# EAGLE design PCBPayloadV7 (EAGLE 9.5.2)
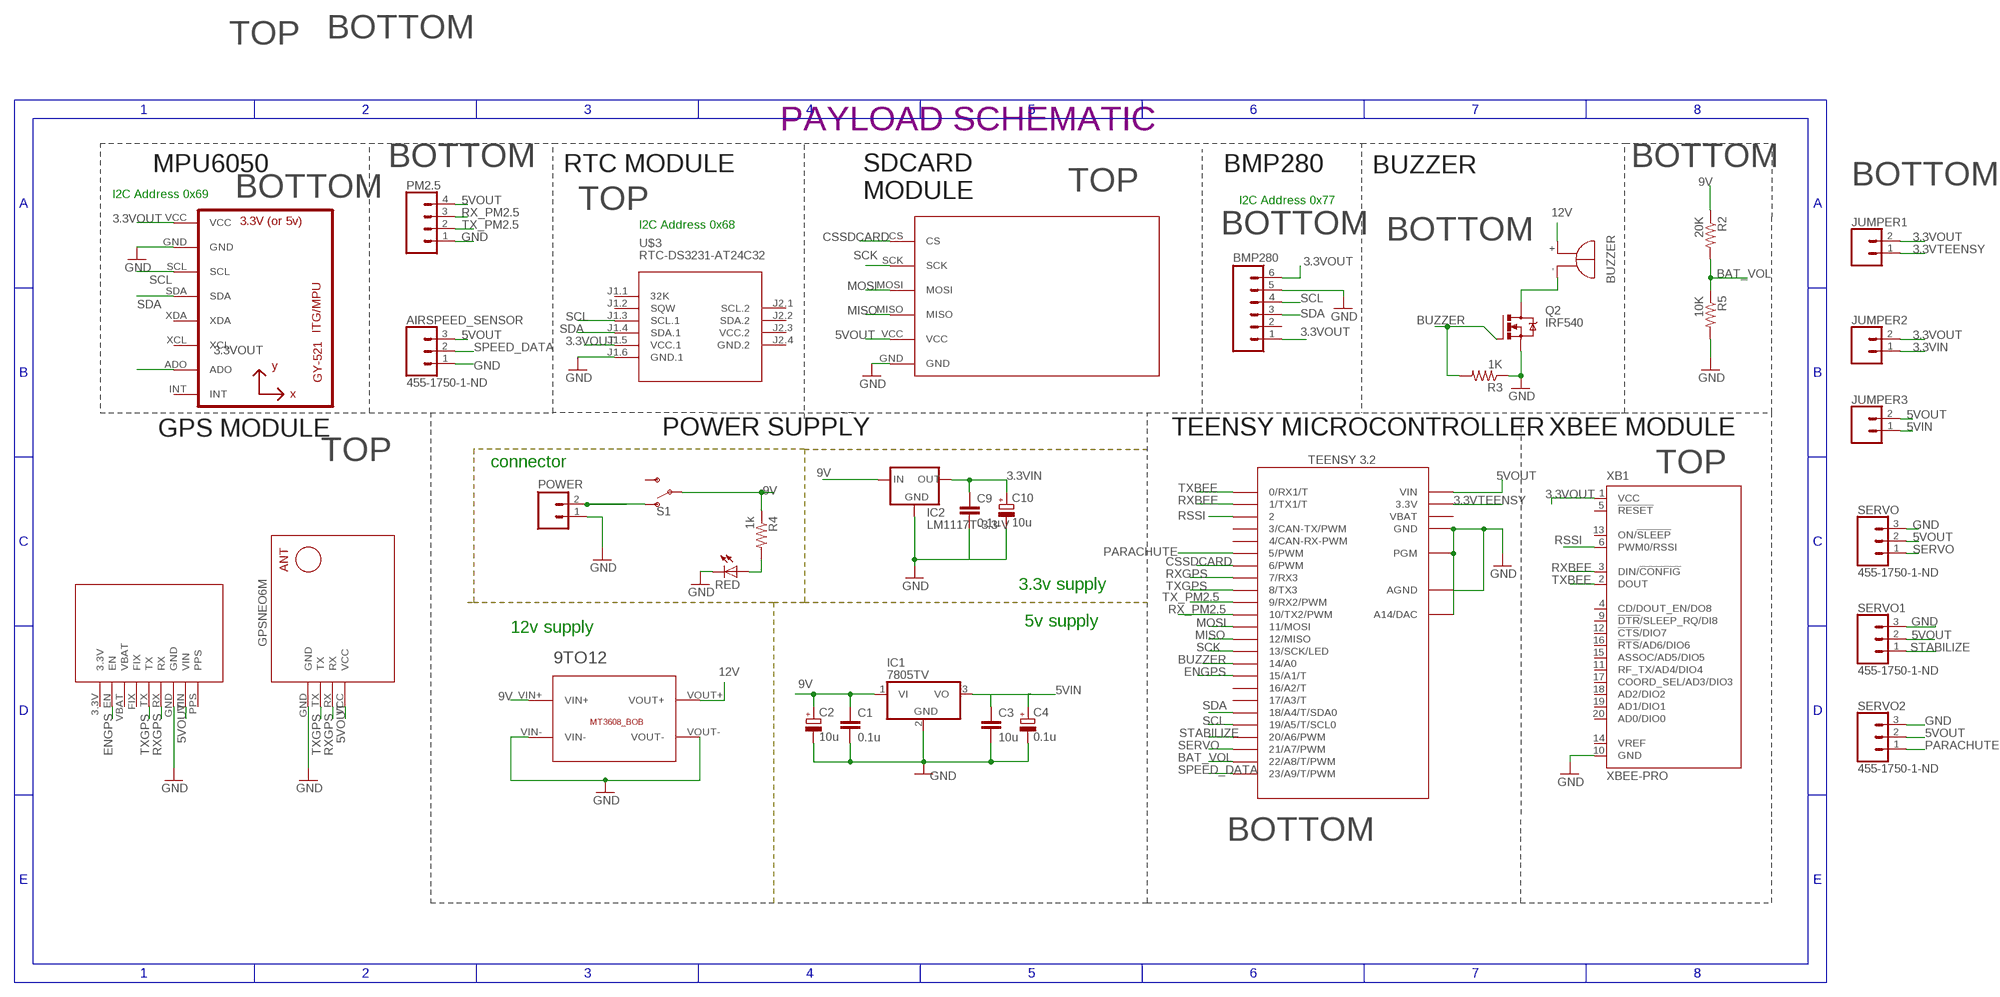
[diagram p0: schematic, sheet 1]

## Parts
9TO12  BREAKOUTS_MT3608_BOB  [BREAKOUTS_MT3608_BOB]
AIRSPEED_SENSOR  455-1750-1-ND  CONN_03  [1X03]
BMP280  M06  [06P]
C1  0.1u  C-EU025-025X050  [C025-025X050]
C2  10u  CPOL-EUE2.5-6  [E2,5-6]
C3  10u  C-EU025-025X050  [C025-025X050]
C4  0.1u  CPOL-EUE2.5-6  [E2,5-6]
C9  0.1u  C-EU025-025X050  [C025-025X050]
C10  10u  CPOL-EUE2.5-6  [E2,5-6]
IC1  7805TV  [TO220V]
IC2  LM1117T-3.3-V  [TO220V]
JUMPER1  CONN_02  [1X02]
JUMPER2  CONN_02  [1X02]
JUMPER3  CONN_02  [1X02]
PM2.5  CONN_04  [1X04]
POWER  CEDT_JANUARY_2015_V5_M02  [CEDT_JANUARY_2015_V5_02P]
Q2  IRF540  [TO220BV]
R2  20K  R-US_0204/7  [0204/7]
R3  1K  R-US_0204/7  [0204/7]
R4  1k  R-US_0204/7  [0204/7]
R5  10K  R-US_0204/7  [0204/7]
RED  red  LED3MM  [LED3MM]
S1  SWITCH-SPDT-PTH-11.6X4.0MM  [SWITCH_SPDT_PTH_11.6X4.0MM]
SERVO  455-1750-1-ND  CONN_03  [1X03]
SERVO1  455-1750-1-ND  CONN_03  [1X03]
SERVO2  455-1750-1-ND  CONN_03  [1X03]
SG1  BUZZER_EB2209A  [BUZZER_EB2209A]
U1  GY-521MPU6050  [GY-521]
U$1  GPS-RECEIVER-NEO6M  [GPS-RECEIVER-NEO6M]
U$2  TEENSY_3.1-3.2_OUTER_ROW  [TEENSY_3.0-3.2&LC_OUTER_ROW]
U$3  RTC-DS3231-AT24C32  [RTC-DS3231-AT24C32]
U$4  ADAFRUIT_GPS  [ADAFRUIT_GPS]
U$5  SDCARD  [M0SDCARDMODULE]
XB1  XBEE-PRO  [XBEE-PRO]

## Nets
3.3VIN: C9.1 C10.+ IC2.2(OUT) JUMPER2.1
3.3VOUT: BMP280.1 BMP280.6 JUMPER1.2 JUMPER2.2 U1.ADO U1.VCC U$3.J1.5(VCC.1) XB1.1(VCC)
3.3VTEENSY: JUMPER1.1 U$2.3.3V U$2.3.3V1(3.3V)
5VIN [power]: C3.1 C4.+ IC1.3(VO) JUMPER3.1
5VOUT: AIRSPEED_SENSOR.3 JUMPER3.2 PM2.5.4 SERVO1.2 SERVO2.2 SERVO.2 U$1.VCC U$2.VIN U$4.VIN U$5.VCC
9V [power]: 9TO12.VIN+ C1.1 C2.+ IC1.1(VI) IC2.3(IN) R2.1 R4.1 S1.2(P)
12V [power]: 9TO12.VOUT+ SG1.+
BAT_VOL: R2.2 R5.1 U$2.22/A8(22/A8/T/PWM)
BUZZER: Q2.G R3.2 U$2.14/A0
CSSDCARD: U$2.6(6/PWM) U$5.CS
ENGPS: U$2.15/A1(15/A1/T) U$4.EN
GND [power]: 9TO12.VIN- 9TO12.VOUT- AIRSPEED_SENSOR.1 BMP280.5 C1.2 C2.- C3.2 C4.- C9.2 C10.- IC1.2(GND) IC2.1(GND) PM2.5.1 POWER.1 Q2.S R3.1 R5.2 RED.K(C) SERVO1.3 SERVO2.3 SERVO.3 U1.GND U$1.GND U$2.AGND U$2.GND U$2.GND1(GND) U$2.PGM U$2.RESET/DAC(A14/DAC) U$3.J1.6(GND.1) U$4.GND U$5.GND XB1.10(GND)
MISO: U$2.12(12/MISO) U$5.MISO
MOSI: U$2.11(11/MOSI) U$5.MOSI
N$1 [power]: POWER.2 S1.1(O)
N$2: R4.2 RED.A
N$3 [power]: Q2.D SG1.-
PARACHUTE: SERVO2.1 U$2.5(5/PWM)
RSSI: U$2.2 XB1.6(PWM0/RSSI)
RX_PM2.5: PM2.5.3 U$2.10(10/TX2/PWM)
RXBEE: U$2.1(1/TX1/T) XB1.3(DIN/!CONFIG)
RXGPS: U$1.RX U$2.7(7/RX3) U$4.RX
SCK: U$2.13(13/SCK/LED) U$5.SCK
SCL: BMP280.4 U1.SCL U$2.19/A5(19/A5/T/SCL0) U$3.J1.3(SCL.1)
SDA: BMP280.3 U1.SDA U$2.18/A4(18/A4/T/SDA0) U$3.J1.4(SDA.1)
SERVO: SERVO.1 U$2.21/A7(21/A7/PWM)
SPEED_DATA: AIRSPEED_SENSOR.2 U$2.23/A9(23/A9/T/PWM)
STABILIZE: SERVO1.1 U$2.20/A6(20/A6/PWM)
TX_PM2.5: PM2.5.2 U$2.9(9/RX2/PWM)
TXBEE: U$2.0(0/RX1/T) XB1.2(DOUT)
TXGPS: U$1.TX U$2.8(8/TX3) U$4.TX
Unconnected: BMP280.2 S1.3(S) U1.INT U1.XCL U1.XDA U$2.3(3/CAN-TX/PWM) U$2.4(4/CAN-RX-PWM) U$2.16/A2(16/A2/T) U$2.17/A3(17/A3/T) U$3.J1.1(32K) U$3.J1.2(SQW) U$3.J2.1(SCL.2) U$3.J2.2(SDA.2) U$4.3.3V U$4.FIX U$4.PPS U$4.VBAT XB1.4(CD/DOUT_EN/DO8) XB1.5(!RESET) XB1.9(!DTR!/SLEEP_RQ/DI8) XB1.11(RF_TX/AD4/DIO4) XB1.12(!CTS!/DIO7) XB1.13(ON/!SLEEP) XB1.14(VREF) XB1.15(ASSOC/AD5/DIO5) XB1.16(!RTS!/AD6/DIO6) XB1.17(COORD_SEL/AD3/DIO3) XB1.18(AD2/DIO2) XB1.19(AD1/DIO1) XB1.20(AD0/DIO0)

## Notes on the sheet
- TOP | BOTTOM
- PAYLOAD SCHEMATIC
- MPU6050 | BOTTOM | RTC MODULE | BMP280 | BUZZER | BOTTOM
- TOP | BOTTOM
- I2C Address 0x69 | BOTTOM
- SDCARD
  MODULE
- I2C Address 0x77
- TOP
- I2C Address 0x68
- BOTTOM | BOTTOM
- GPS MODULE | POWER SUPPLY | TEENSY MICROCONTROLLER | XBEE MODULE
- TOP
- connector
- TOP
- 3.3v supply
- 5v supply
- 12v supply
- BOTTOM

## Power pins joined to a net without a drawn wire
GND.2: U$3.J2.4(GND.2)
VBAT: U$2.VBAT
VCC.2: U$3.J2.3(VCC.2)

## Library data of the parts
9TO12 = Cansat2019_3279_Container_v01:BREAKOUTS_MT3608_BOB
AIRSPEED_SENSOR SERVO SERVO1 SERVO2 = SparkFun-Connectors:CONN_03: Multi connection point. Often used as Generic Header-pin footprint for 0.1 inch spaced/style header connections On any of the 0.1 inch spaced packages, you can populate with these: Break Away Headers - Straight <https://www.sparkfun.com/products/116> (PRT-00116) Break Away Male Headers - Right Angle <https://www.sparkfun.com/products/553> (PRT-00553) Female Headers <https://www.sparkfun.com/products/115> (PRT-00115) Break Away Headers - Machine Pin <https://www.sparkfun.com/products/117> (PRT-00117) Break Away Female Headers - Swiss Machine Pin <https://www.sparkfun.com/products/743> (PRT-00743) Stackable Header - 3 Pin (Female, 0.1") <https://www.sparkfun.com/products/13875> (PRT-13875) For SCREWTERMINALS and SPRING TERMINALS visit here: Screw Terimnals on SparkFun.com <https://www.sparkfun.com/search/results?term=Screw+Terminals> (5mm/3.5mm/2.54mm spacing) This device is also useful as a general connection point to wire up your design to another part of your project. Our various solder wires solder well into these plated through hole pads. Hook-Up Wire - Assortment (Stranded, 22 AWG) <https://www.sparkfun.com/products/11375> (PRT-11375) Hook-Up Wire - Assortment (Solid Core, 22 AWG) <https://www.sparkfun.com/products/11367> (PRT-11367) View the entire wire category on our website here <https://www.sparkfun.com/categories/141> Special notes: Molex polarized connector foot print use with SKU : PRT-08232 with associated crimp pins and housings.; PROD_ID: XXX-00000
BMP280 = con-amp-quick:M06: AMP QUICK CONNECTOR; OC_FARNELL: unknown; OC_NEWARK: unknown
C1 C3 C9 = resistor:C-EU: CAPACITOR, European symbol
C2 C4 C10 = rcl:CPOL-EU: POLARIZED CAPACITOR, European symbol; SPICEPREFIX: C
IC1 = linear:78*: Positive VOLTAGE REGULATOR Source: http://cache.national.com/ds/LM/LM78L05.pdf http://www.fairchildsemi.com/ds/LM/LM7805.pdf
IC2 = lm1117:LM1117T-*
JUMPER1-JUMPER3 = SparkFun-Connectors:CONN_02: Multi connection point. Often used as Generic Header-pin footprint for 0.1 inch spaced/style header connections On any of the 0.1 inch spaced packages, you can populate with these: Break Away Headers - Straight <https://www.sparkfun.com/products/116> (PRT-00116) Break Away Male Headers - Right Angle <https://www.sparkfun.com/products/553> (PRT-00553) Female Headers <https://www.sparkfun.com/products/115> (PRT-00115) Break Away Headers - Machine Pin <https://www.sparkfun.com/products/117> (PRT-00117) Break Away Female Headers - Swiss Machine Pin <https://www.sparkfun.com/products/743> (PRT-00743) For SCREWTERMINALS and SPRING TERMINALS visit here: Screw Terimnals on SparkFun.com <https://www.sparkfun.com/search/results?term=Screw+Terminals> (5mm/3.5mm/2.54mm spacing) This device is also useful as a general connection point to wire up your design to another part of your project. Our various solder wires solder well into these plated through hole pads. Hook-Up Wire - Assortment (Stranded, 22 AWG) <https://www.sparkfun.com/products/11375> (PRT-11375) Hook-Up Wire - Assortment (Solid Core, 22 AWG) <https://www.sparkfun.com/products/11367> (PRT-11367) View the entire wire category on our website here <https://www.sparkfun.com/categories/141> Special notes: Molex polarized connector foot print use with: PRT-08233 with associated crimp pins and housings. 2.54_SCREWTERM for use with PRT-10571. 3.5mm Screw Terminal footprints for PRT-08084 5mm Screw Terminal footprints for use with PRT-08432
PM2.5 = SparkFun-Connectors:CONN_04: Multi connection point. Often used as Generic Header-pin footprint for 0.1 inch spaced/style header connections On any of the 0.1 inch spaced packages, you can populate with these: Break Away Headers - Straight <https://www.sparkfun.com/products/116> (PRT-00116) Break Away Male Headers - Right Angle <https://www.sparkfun.com/products/553> (PRT-00553) Female Headers <https://www.sparkfun.com/products/115> (PRT-00115) Break Away Headers - Machine Pin <https://www.sparkfun.com/products/117> (PRT-00117) Break Away Female Headers - Swiss Machine Pin <https://www.sparkfun.com/products/743> (PRT-00743) For SCREWTERMINALS and SPRING TERMINALS visit here: Screw Terimnals on SparkFun.com <https://www.sparkfun.com/search/results?term=Screw+Terminals> (5mm/3.5mm/2.54mm spacing) This device is also useful as a general connection point to wire up your design to another part of your project. Our various solder wires solder well into these plated through hole pads. Hook-Up Wire - Assortment (Stranded, 22 AWG) <https://www.sparkfun.com/products/11375> (PRT-11375) Hook-Up Wire - Assortment (Solid Core, 22 AWG) <https://www.sparkfun.com/products/11367> (PRT-11367) View the entire wire category on our website here <https://www.sparkfun.com/categories/141> Special notes: Molex polarized connector foot print use with SKU : PRT-08231 with associated crimp pins and housings. 1MM SMD Version SKU: PRT-10208; PROD_ID: CONN-09696
POWER = Cansat2019_3279_Container_v01:CEDT_JANUARY_2015_V5_M02: AMP QUICK CONNECTOR
Q2 = transistor-power:IRF540: HEXFET Power MOSFET
R2-R5 = rcl:R-US_: RESISTOR, American symbol; SPICEPREFIX: R
RED = CEDT_JANUARY_2015_v5:LED
S1 = SparkFun-Switches:SWITCH-SPDT: Single Pole, Double Throw (SPDT) Switch Single-pole, double-throw (SPDT) switch. Variant Overview SMD-AYZ0202 Surface Mount DPDT Switch <https://www.sparkfun.com/products/597> (COM-00597) Used on e.g. LilyPad Arduino USB - ATmega32U4 Board <https://www.sparkfun.com/products/12049> PTH-11.6X4.0MM SPDT Mini Power Switch <https://www.sparkfun.com/products/102> (COM-00102) Used on e.g. SparkFun Simon Says - Through-Hole Soldering Kit <https://www.sparkfun.com/products/10547> (KIT-10547) PTH-11.6X4.0MM-KIT KIT version of SPDT Mini Power Switch - Simplifies soldering by removing tStop of switch pins - only one side can be soldered. PTH-11.6X4.0MM-LOCK LOCK version of SPDT Mini Power Switch - Offset pins hold switch in place for easier soldering. SMD-RIGHT-ANGLE Surface Mount Right Angle Switch <https://www.sparkfun.com/products/10860> (COM-10860) Used on e.g. SparkFun ESP8266 Thing <https://www.sparkfun.com/products/13231>; PROD_ID: SWCH-08261; SF_SKU: COM-00102
SG1 = Cansat2019_3279_Container_v01:BUZZER_EB2209A: BUZZER Source: Buerklin; OC_FARNELL: unknown; OC_NEWARK: unknown
U1 = gy-521:GY-521
U$1 = diy-modules:GPS-RECEIVER-NEO6M: GPS Receiver Module based on NEO-6 device Short tutorial how to use NEO-6 module with Arduino: http://www.xarg.org/2016/06/neo6mv2-gps-module-with-arduino/ NEO-6 datasheet is available here: https://www.u-blox.com/sites/default/files/products/documents/NEO-6_DataSheet_%28GPS.G6-HW-09005%29.pdf Click here to find device on ebay.com <http://www.ebay.com/sch/gyneo6mv2>
U$2 = Teensy_3_and_LC_Series_Boards_v1.4:TEENSY_3.1-3.2_OUTER_ROW: Footprint for Teensy 3.1 or 3.2 board using all pin connections on the outer perimeter
U$3 = diy-modules:RTC-DS3231-AT24C32: RTC Module with Battery and EEPROM based on DS3231 and AT24C32 chips Tutorial can be found here: https://edwardmallon.wordpress.com/2014/05/21/using-a-cheap-3-ds3231-rtc-at24c32-eeprom-from-ebay/ Click here to find device on ebay.com <http://www.ebay.com/sch/DS3231+AT24C32+module>
U$4 = myLib_adafruit_gps:ADAFRUIT_GPS
U$5 = mylib:SDCARD
XB1 = maxstream:XBEE: XBee (TM) /XBee-PRO(TM) OEM RF Modules Source: MaxStream, Inc. xbee_productmanual.pdf; MPN: XBP24-AWI-001; OC_FARNELL: 1337916; OC_NEWARK: 42M2667

## Net classes
0 default: width 0.508 mm
1 power: width 0.61 mm

## Board
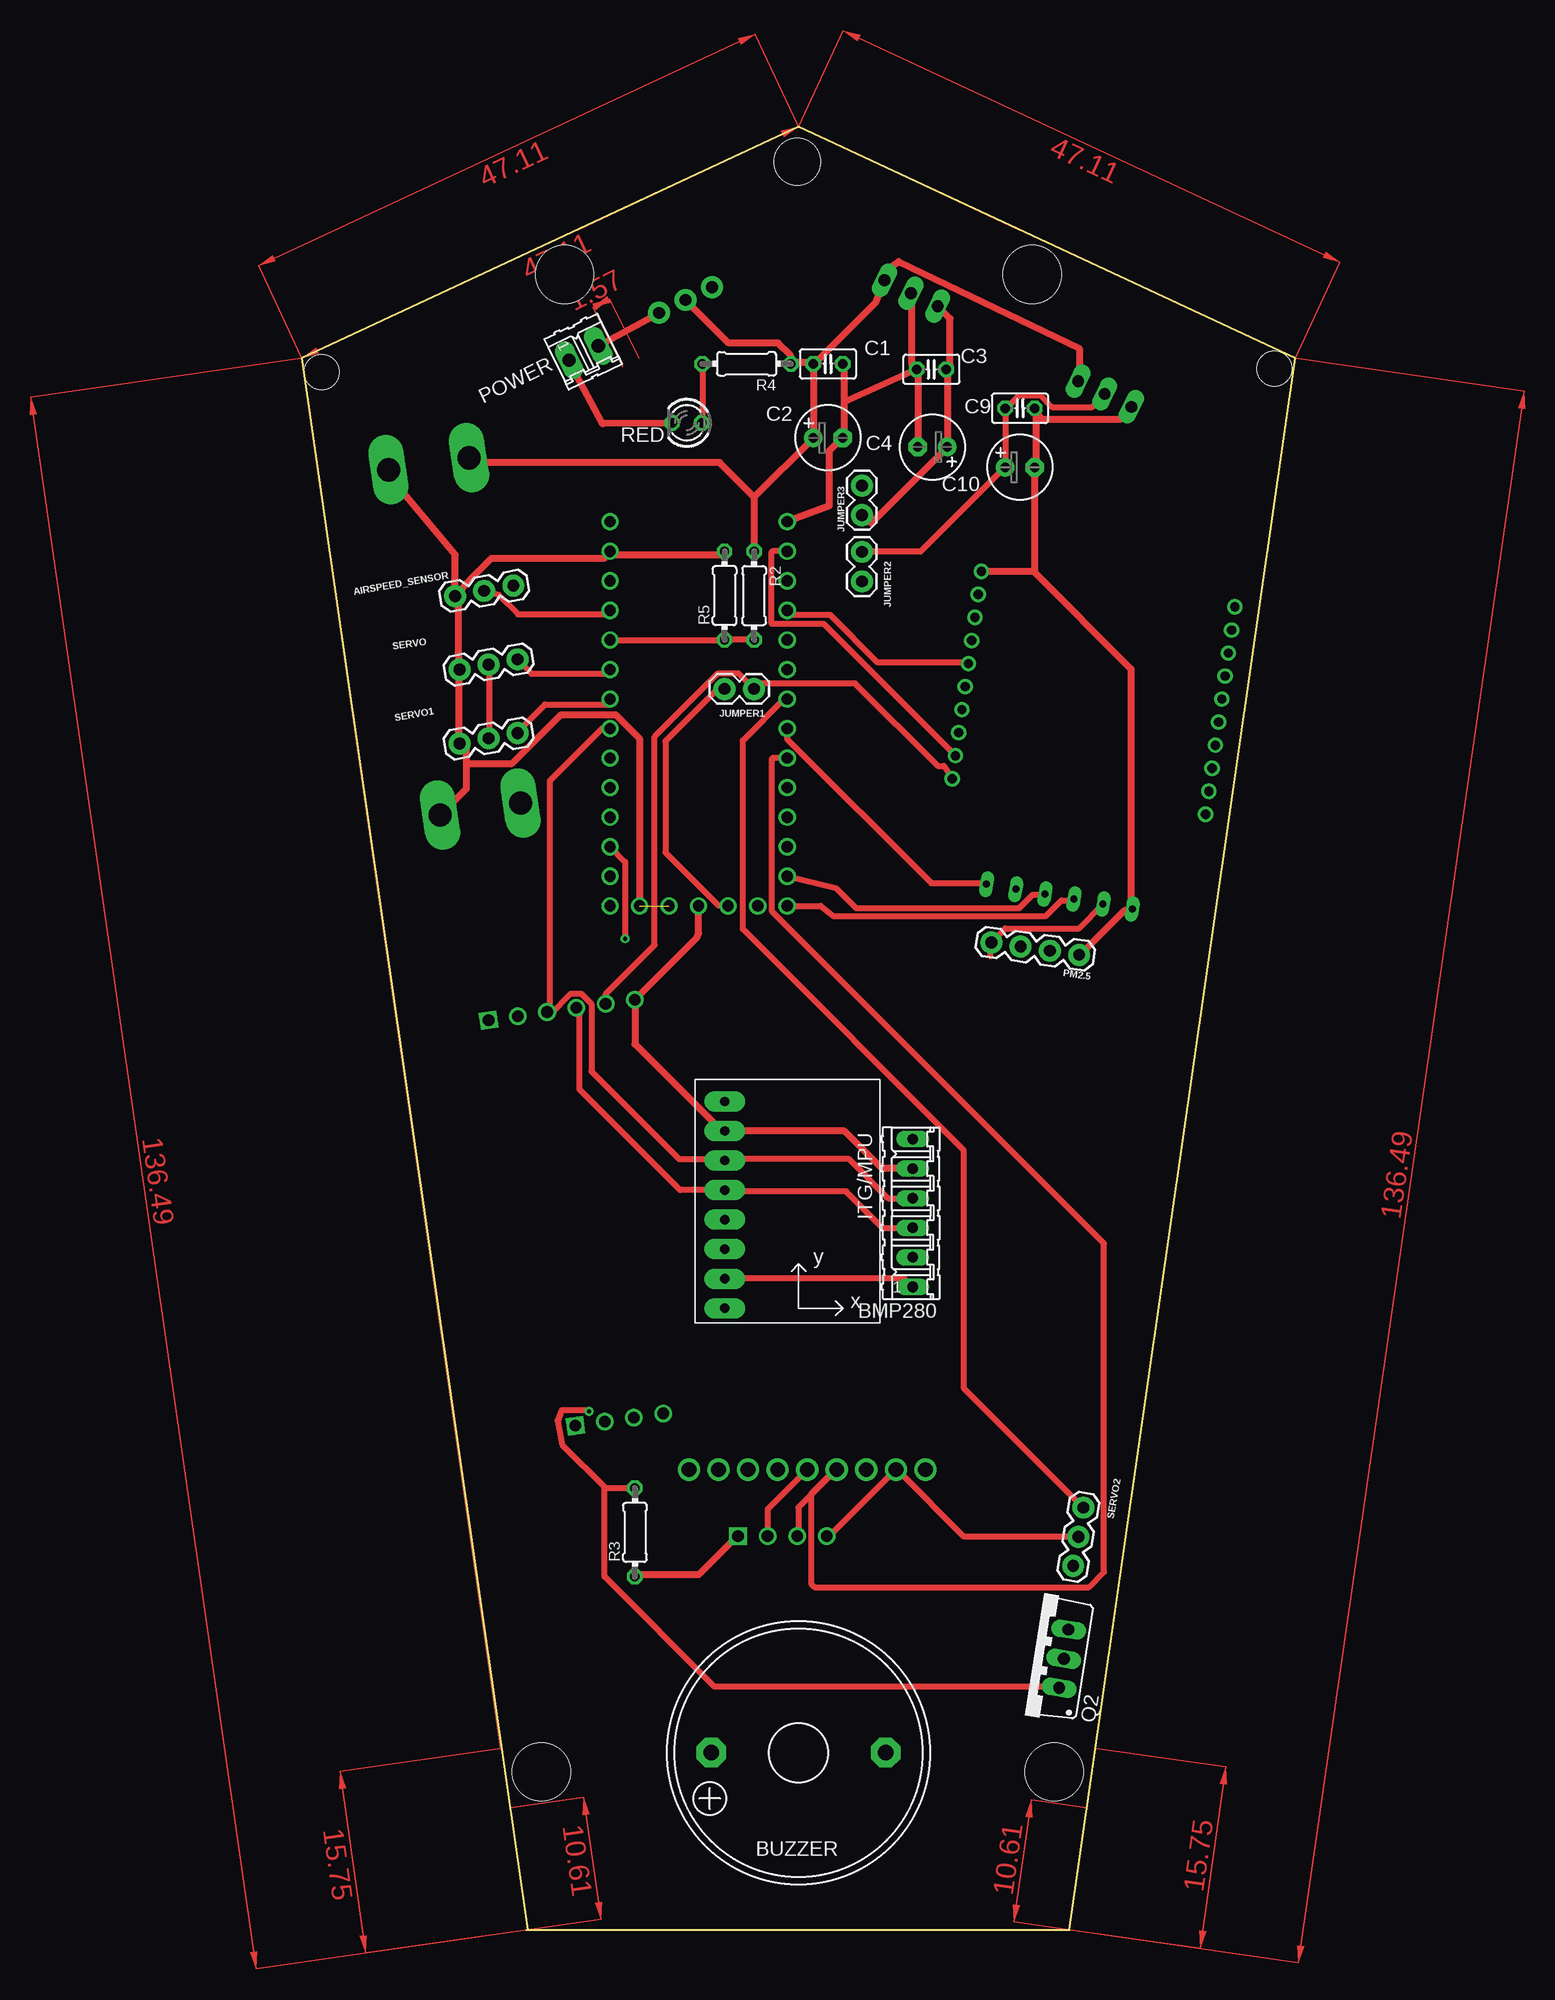
[diagram p1: board, top side]
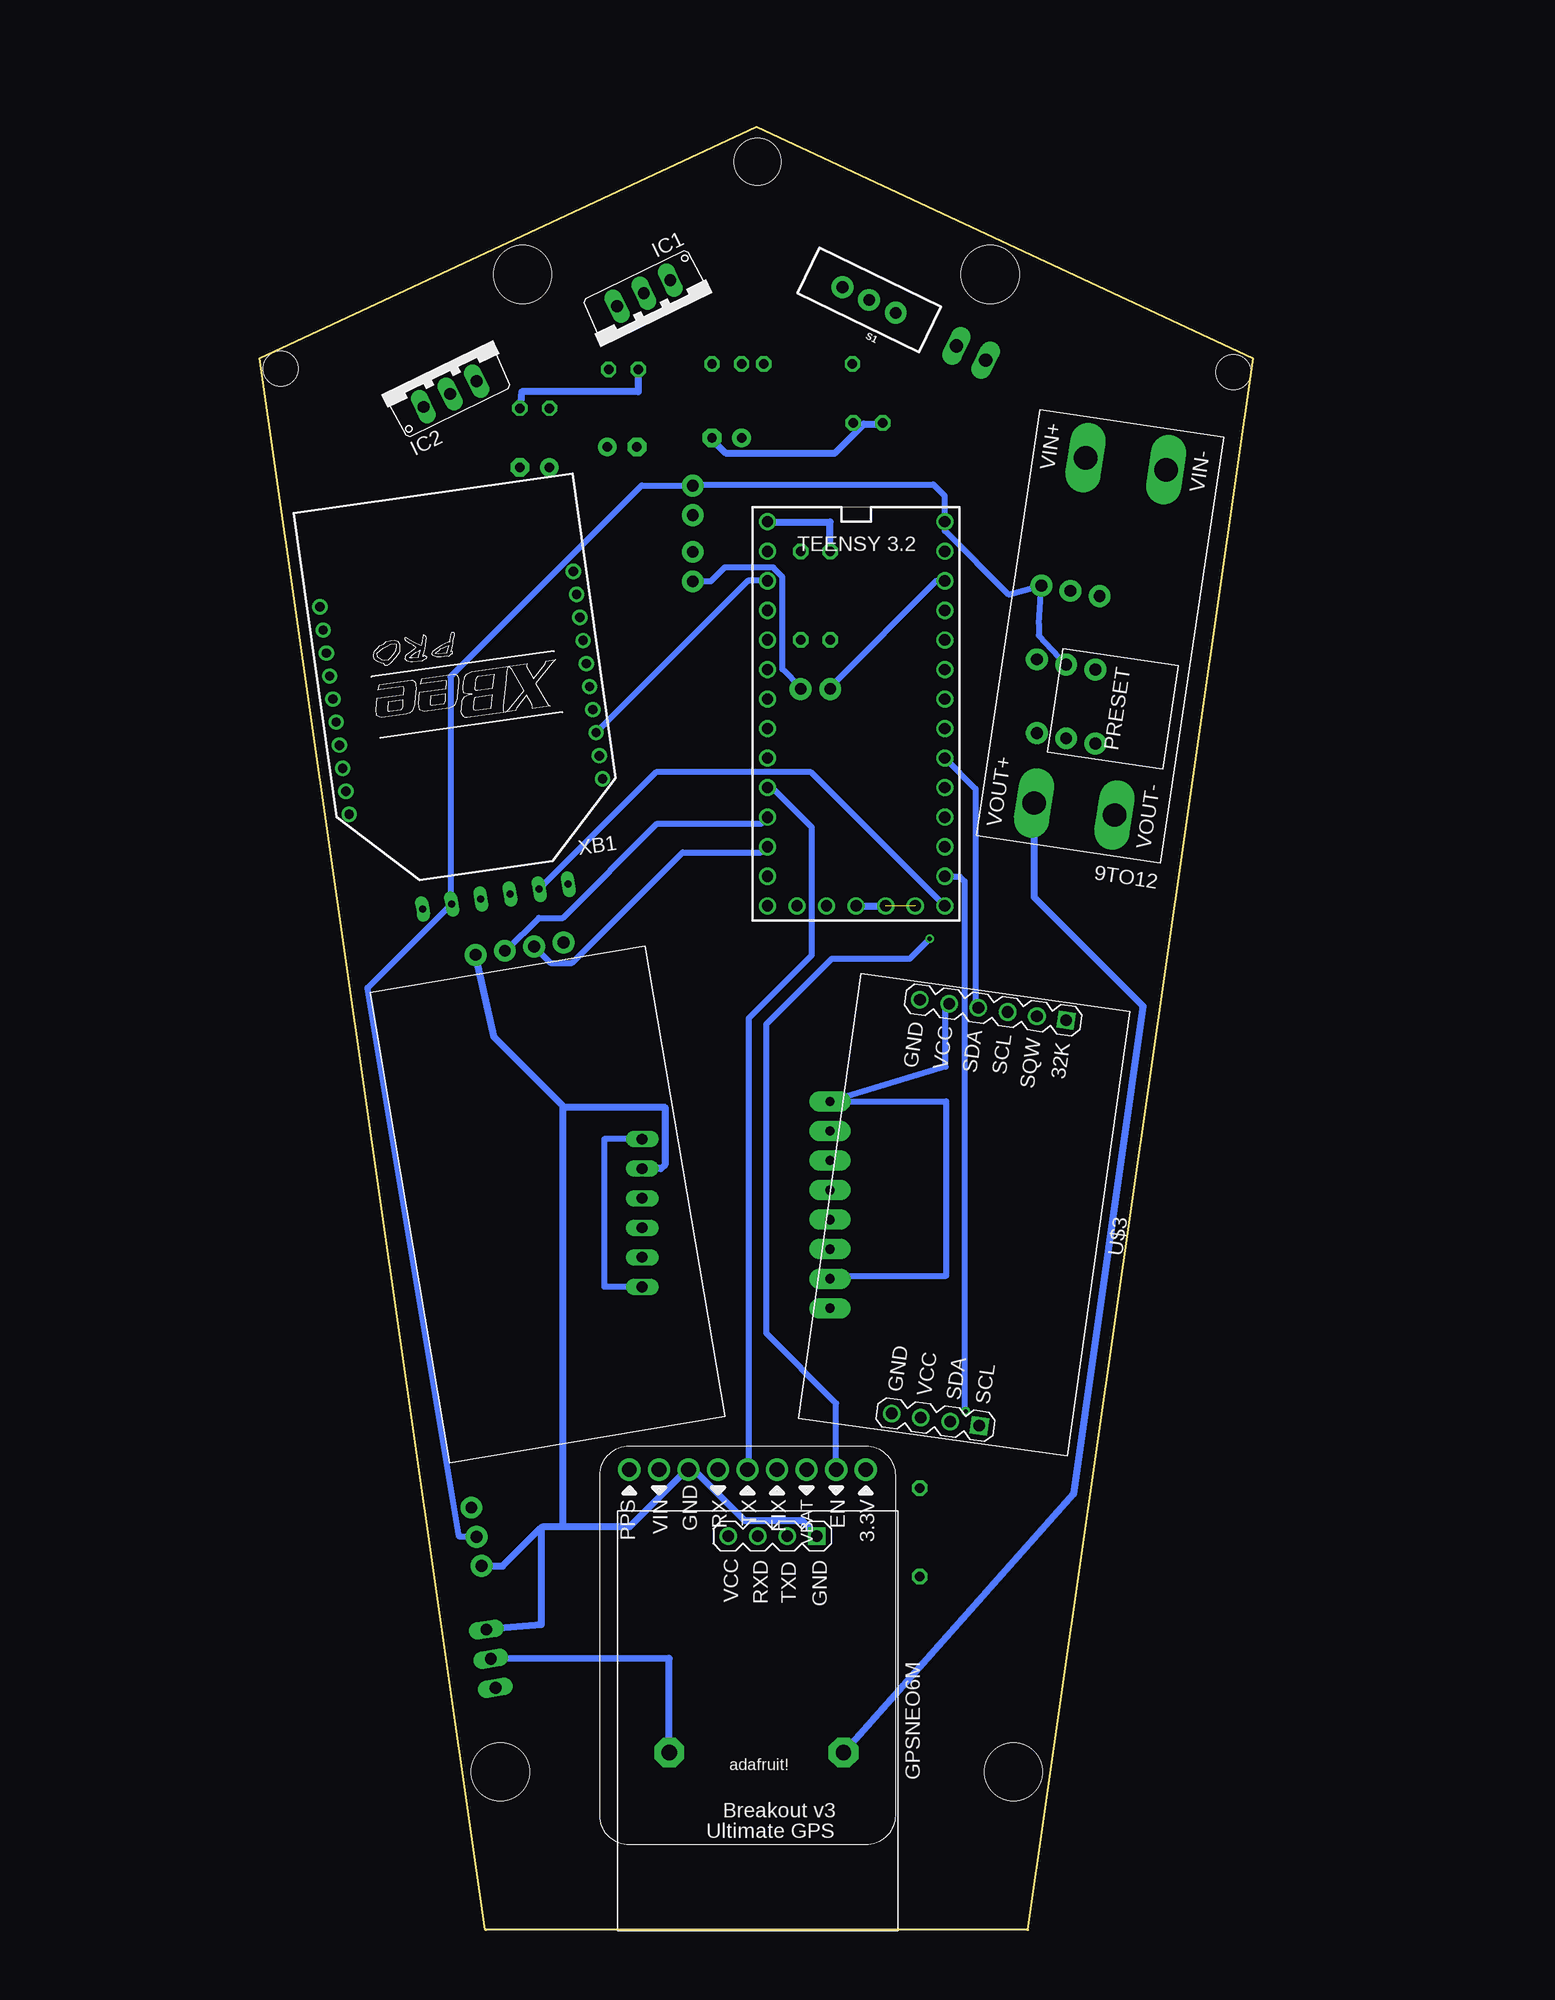
[diagram p2: board, bottom side, seen from below]

Size 85.4 x 155 mm. Coordinates in mm from the lower left corner, seen from the top.
Outline: 19.31,0 65.91,0
Outline: 66,0 85.4,135.1 42.7,155 0,135.1 19.4,0
Copper layers (1*16): Top 0.035mm / dielectric 1.5mm / Bottom 0.035mm
Design rules "default": minimum track width 6mil, minimum drill 0.35mm, track to track 6mil, track to pad 6mil, pad to pad 6mil, via to via 6mil, smd to smd 6mil, copper to edge 40mil, drill to drill 6mil, minimum pad ring 10mil, minimum via ring 8mil, stop-mask expansion 4mil, vias tented up to drill 0mil, thermal gap 10mil
Holes 4 mm at 42.6,152
Holes 5 mm at 20.6,13.6 64.7,13.6 22.6,142.3 62.8,142.3
Holes 3 mm at 1.7,133.9 83.6,134.2

### Footprints (pad centres in the part's own frame; a part is rotated, then mirrored left to right if it is on the bottom)
BREAKOUTS_MT3608_BOB = drill 2 pad 3 long: VIN+ 33.5,-4.5; VIN- 33.5,-11.5; VOUT+ 3.5,-4.5; VOUT- 3.5,-11.5
1X03 = drill 1.016 pad 1.88: 1 0,0; 2 2.54,0; 3 5.08,0
06P = drill 0.914 long: 1 -6.35,0; 2 -3.81,0; 3 -1.27,0; 4 1.27,0; 5 3.81,0; 6 6.35,0
C025-025X050 = drill 0.813 octagon: 1 -1.27,0; 2 1.27,0
E2,5-6 = drill 0.813 pad 1.6: + -1.27,0 | drill 0.813 pad 1.6 octagon: - 1.27,0
TO220V = drill 1.016 long: 1 -2.54,-2.54; 2 0,-2.54; 3 2.54,-2.54
1X02 = drill 1.016 pad 1.88: 1 0,0; 2 2.54,0
1X04 = drill 1.016 pad 1.88: 1 0,0; 2 2.54,0; 3 5.08,0; 4 7.62,0
CEDT_JANUARY_2015_V5_02P = drill 1.143 long: 1 -1.397,0; 2 1.397,0
TO220BV = drill 1.016 long: D 0,-2.54; G -2.54,-2.54; S 2.54,-2.54
0204/7 = drill 0.813 octagon: 1 -3.81,0; 2 3.81,0
LED3MM = drill 0.813 octagon: A -1.27,0; K 1.27,0
SWITCH_SPDT_PTH_11.6X4.0MM = drill 1.016 pad 1.88: 1 0,2.54; 2 0,0; 3 0,-2.54
BUZZER_EB2209A = drill 1.321 pad 2.54 octagon: + 7.493,0; - -7.493,0
GY-521 = drill 0.8 pad 1.778 long: ADO -8.89,-6.35; GND -8.89,6.35; INT -8.89,-8.89; SCL -8.89,3.81; SDA -8.89,1.27; VCC -8.89,8.89; XCL -8.89,-3.81; XDA -8.89,-1.27
GPS-RECEIVER-NEO6M = drill 1 square: GND -15.875,5.08 | drill 1: RX -15.875,0; TX -15.875,2.54; VCC -15.875,-2.54
TEENSY_3.0-3.2&LC_OUTER_ROW = drill 0.965: 0 -7.62,13.97; 1 -7.62,11.43; 2 -7.62,8.89; 3 -7.62,6.35; 3.3V 7.62,11.43; 3.3V1 -2.54,-16.51; 4 -7.62,3.81; 5 -7.62,1.27; 6 -7.62,-1.27; 7 -7.62,-3.81; 8 -7.62,-6.35; 9 -7.62,-8.89; 10 -7.62,-11.43; 11 -7.62,-13.97; 12 -7.62,-16.51; 13 7.62,-16.51; 14/A0 7.62,-13.97; 15/A1 7.62,-11.43; 16/A2 7.62,-8.89; 17/A3 7.62,-6.35; 18/A4 7.62,-3.81; 19/A5 7.62,-1.27; 20/A6 7.62,1.27; 21/A7 7.62,3.81; 22/A8 7.62,6.35; 23/A9 7.62,8.89; AGND 7.62,13.97; GND -7.62,16.51; GND1 0,-16.51; PGM 2.54,-16.51; RESET/DAC 5.08,-16.51; VBAT -5.08,-16.51; VIN 7.62,16.51
RTC-DS3231-AT24C32 = drill 1 square: J1.1 -17.78,6.35; J2.1 17.78,3.81 | drill 1: J1.2 -17.78,3.81; J1.3 -17.78,1.27; J1.4 -17.78,-1.27; J1.5 -17.78,-3.81; J1.6 -17.78,-6.35; J2.2 17.78,1.27; J2.3 17.78,-1.27; J2.4 17.78,-3.81
ADAFRUIT_GPS = drill 1.27: 3.3V 2.54,2.032; EN 5.08,2.032; FIX 10.16,2.032; GND 17.78,2.032; PPS 22.86,2.032; RX 15.24,2.032; TX 12.7,2.032; VBAT 7.62,2.032; VIN 20.32,2.032
M0SDCARDMODULE = drill 0.6 long: CS -6.35,6.35; GND -6.35,-6.35; MISO -6.35,-1.27; MOSI -6.35,1.27; SCK -6.35,3.81; VCC -6.35,-3.81
XBEE-PRO = drill 0.8 pad 1.27: 1 -11,9; 2 -11,7; 3 -11,5; 4 -11,3; 5 -11,1; 6 -11,-1; 7 -11,-3; 8 -11,-5; 9 -11,-7; 10 -11,-9; 11 11,-9; 12 11,-7; 13 11,-5; 14 11,-3; 15 11,-1; 16 11,1; 17 11,3; 18 11,5; 19 11,7; 20 11,9

### Placement (x,y rotation side)
9TO12  23.79,94.08 81.5 bottom
AIRSPEED_SENSOR  13.19,114.67 10 top
BMP280  52.52,61.63 90 top
C1  45.24,134.62 0 top
C2  45.24,128.27 0 top
C3  54.13,134.15 180 top
C4  54.23,127.47 180 top
C9  61.75,130.81 0 top
C10  61.75,125.73 0 top
IC1  51.27,138.41 205.9 bottom
IC2  70.14,134.32 25.9 bottom
JUMPER1  36.35,106.68 0 top
JUMPER2  48.16,118.46 270 top
JUMPER3  48.16,121.62 90 top
PM2.5  66.83,83.82 172 top
POWER  24.25,135.55 25.9 top
Q2  63.01,23.71 81 top
R2  38.89,114.7 270 top
R3  28.65,34.18 90 top
R4  38.25,134.62 180 top
R5  36.35,114.7 90 top
RED  33.11,129.54 180 top
S1  33,140.11 244.1 bottom
SERVO  18.57,109.22 190 top
SERVO1  18.57,102.87 190 top
SERVO2  67.2,36.3 260 top
SG1  42.7,15.24 180 top
U1  45.26,62.33 0 top
U$1  42.59,17.97 270 bottom
U$2  34.12,104.54 0 bottom
U$3  24.83,61.48 262 bottom
U$4  30.76,41.6 180 bottom
U$5  64.08,82.57 279.6 bottom
XB1  68.07,106.34 188 bottom

### Tracks (layer width: path | path; a pad name or v marks a point on that pad's centre or on a via)
3.3VIN
  Top 0.508: IC2.2 69.03,131.99 67.97,130.92 64.5,130.92 63.5,131.91 61.69,131.91 60.7,130.92 C9.1 60.53,130.76 60.53,125.81 C10.+ 60.45,125.73 53.19,118.46 JUMPER2.1
3.3VOUT
  Top 0.508: XB1.1 55.2,100.05 54.68,100.05 47.57,107.16 39.37,107.16 JUMPER1.2 37.54,108.03 35.79,108.03 30.34,102.58 30.34,84.67 26.13,80.45 U$3.J1.5 | U1.ADO 36.39,56 51.8,56 BMP280.1
  Bottom 0.508: BMP280.6 55.78,67.98 55.78,55.28 BMP280.1 | U$3.J1.5 26.43,79.59 26.43,74.2 U1.VCC 26.4,71.22 26.4,56.23 36.12,56.23 U1.ADO | JUMPER1.2 38.89,106.81 40.46,108.38 40.46,116.31 41.27,117.11 45.43,117.11 46.62,115.92 JUMPER2.2
3.3VTEENSY
  Top 0.508: U$2.3.3V1 35.86,88.03 31.26,92.63 31.26,102.19 35.75,106.68 JUMPER1.1
  Bottom 0.508: U$2.3.3V 27.2,115.97 36.1,107.07 36.26,107.07 36.26,106.82 JUMPER1.1
5VIN
  Top 0.61: IC1.3 55.74,138.52 55.74,134.49 C3.1 55.5,134.05 C4.+ 48.96,120.93 JUMPER3.1
5VOUT
  Top 0.508: SERVO1.2 16.12,103.02 16.12,109.13 SERVO.2 | U$1.VCC 45.18,34.01 45.51,34.01 50.96,39.46 U$4.VIN 51.29,39.46 56.95,33.8 SERVO2.2 | 59.21,83.71 PM2.5.4 60.5,86.09 66.79,86.09 U$5.VCC
  Bottom 0.508: SERVO.2 18.42,111.27 18.42,112.31 AIRSPEED_SENSOR.3 21.02,114.8 26.5,120.28 U$2.VIN 26.5,123.25 27.49,124.24 48.08,124.24 JUMPER3.2 52.56,124.16 68.99,107.73 68.99,88.28 U$5.VCC 76.12,80.97 68.25,33.8 SERVO2.2
9V
  Top 0.61: C1.1 43.86,134.72 42.12,134.72 R4.1 42.06,135.32 40.97,136.41 36.7,136.41 S1.2 | C1.1 44.19,134.72 49.32,139.86 IC1.1 50.1,142.63 51.34,143.41 66.85,135.96 66.85,133.15 IC2.3 | 38.9,123.17 38.9,118.61 R2.1 | 38.9,123.17 43.86,128.12 C2.+ 44.02,128.45 44.02,134.39 C1.1 | 38.9,123.17 35.93,126.14 13.79,126.14 9TO12.VIN+
12V
  Bottom 0.61: SG1.+ 15.44,37.48 9.45,79.41 18.82,88.78 9TO12.VOUT+
BAT_VOL
  Top 0.508: R2.2 38.86,110.92 36.38,110.92 R5.1 36.31,110.85 26.65,110.85 U$2.22/A8
BUZZER  (via drill 0.35)
  Top 0.508: Q2.G 65.11,20.92 35.48,20.92 26.03,30.38 26.03,37.91 26.07,37.99 R3.2 26.11,37.99 22.4,41.7 21.99,43.78 22.36,44.68 24.6,44.68 v24.7,44.58
  Bottom 0.508: v24.7,44.58 24.7,44.78 24.8,44.78 24.8,90.14 25.23,90.57 U$2.14/A0
CSSDCARD
  Top 0.508: U$2.6 41.74,102.36 54.12,89.98 58.72,89.98 U$5.CS
ENGPS  (via drill 0.35)
  Top 0.508: U$2.15/A1 27.8,91.81 v27.8,85.2
  Bottom 0.508: U$4.EN 35.84,45.27 41.87,51.3 41.87,77.84 36.21,83.5 29.5,83.5 v27.8,85.2
GND  (1 unrouted)
  Top 0.61: R3.1 28.82,30.54 34.12,30.54 37.42,33.85 U$1.GND | PM2.5.1 66.97,83.87 70.77,87.67 71.26,87.67 U$5.GND 71.3,87.87 71.3,108.39 62.9,116.78 XB1.10 63.02,116.78 C10.- 63.17,125.97 63.17,130.76 C9.2 63.57,129.86 70.38,129.86 71.31,130.8 IC2.1 | BMP280.5 49.9,65.44 46.66,68.68 U1.GND 36.12,68.68 28.64,76.16 U$3.J1.6 33.95,85.27 34.12,85.69 U$2.GND1 | AIRSPEED_SENSOR.1 13.48,114.67 13.48,109.46 SERVO.3 13.48,109.13 13.48,103.02 SERVO1.3 13.64,102.69 14.14,102.2 14.14,100.27 | AIRSPEED_SENSOR.1 13.19,118.21 7.21,125.34 | 7.21,125.34 7.19,125.37 | C4.- 52.96,134.05 C3.2 | C3.2 52.43,134.58 52.43,140.66 IC1.2 | R5.2 36.09,118.21 26.95,118.21 U$2.AGND 26.01,117.88 16.28,117.88 14.6,116.2 AIRSPEED_SENSOR.1 | 46.66,131.36 46.66,128.28 C2.- 46.33,128.12 45.34,127.13 45.34,122.4 U$2.GND | 46.66,131.36 46.66,134.56 C1.2 | 46.66,131.36 C3.2 | 14.14,100.27 18.09,100.27 22.28,104.46 26.99,104.46 29.04,102.42 U$2.RESET/DAC | 9TO12.VIN- 7.37,125.48 7.21,125.34 | 14.14,100.27 14.14,98.08 9TO12.VOUT- | RED.K 25.87,129.47 23.58,133.75 22.99,134.64 POWER.1
  Bottom 0.61: 61.19,34.51 61.19,26.23 Q2.S | U$1.GND 37.58,34.01 38.74,35.17 43.69,35.17 47.98,39.46 48.48,39.46 U$4.GND 48.81,39.46 53.6,34.67 59.38,34.67 | 59.38,34.67 61.03,34.67 61.19,34.51 | 59.19,70.69 50.51,70.69 50.51,65.82 50.9,65.44 BMP280.5 | PM2.5.1 65.26,76.76 59.38,70.88 59.38,34.67 | R5.2 36.35,121.02 41.73,121.02 U$2.GND | RED.K 31.93,129.44 33.45,129.44 35.93,126.96 45.34,126.96 46.5,128.12 C2.- | C3.2 52.86,132.22 62.86,132.22 C9.2 | U$2.PGM 31.64,88 34.12,88 U$2.GND1 | 61.19,34.51 61.29,34.51 64.5,31.3 SERVO2.3
MISO
  Top 0.508: U$5.MISO 66.31,88.49 65.32,88.49 64,87.17 45.67,87.17 44.6,88.03 U$2.12
MOSI
  Top 0.508: U$5.MOSI 63.83,88.99 62.84,88.99 61.69,87.83 47.65,87.83 45.98,89.51 U$2.11
N$1
  Top 0.61: S1.1 | S1.1 30.29,138.72 POWER.2 | POWER.2
N$2
  Top 0.508: R4.2 34.44,129.6 RED.A
N$3
  Bottom 0.61: SG1.- 50.19,23.33 50.23,23.36 Q2.D
PARACHUTE
  Top 0.508: SERVO2.1 56.9,46.6 56.9,67.04 37.92,86.02 37.92,102.25 41.6,105.94 41.87,105.66 U$2.5
RSSI
  Top 0.508: U$2.2 41.74,113.3 41.98,113.06 45.43,113.06 49.51,108.96 57.22,108.96 XB1.6
RX_PM2.5
  Top 0.508: PM2.5.3 61.97,83.82
  Bottom 0.508: PM2.5.3 60.4,83.13 58.53,83.13 49.04,92.62 42.3,92.62 U$2.10
RXBEE
  Bottom 0.508: XB1.3 43.43,115.97 U$2.1
RXGPS
  Top 0.508: U$2.7 40.44,100.73 40.44,87.54 68.98,59.01 68.98,30.78 67.67,29.47 44.1,29.47 43.8,29.77 43.8,37.47 45.9,39.57 U$4.RX 45.84,39.46 42.7,36.32 42.7,34.01 U$1.RX
SCK
  Bottom 0.508: U$5.SCK 61.36,89.48 51.32,99.52 38,99.52 29.85,91.37 29.83,91.36 U$2.13
SCL
  Top 0.508: BMP280.4 50.42,62.9 47.06,66.26 36.49,66.26 U1.SCL 36.27,66.24 32.47,66.24 24.9,73.81 24.9,79.61 24.03,80.48 23.13,80.48 21.35,78.7 | U$2.19/A5 25.83,103.27 21.35,98.79 21.35,78.7 | 21.35,78.7 21.12,78.47 U$3.J1.3
SDA
  Top 0.508: BMP280.3 49.92,60.36 46.79,63.49 36.48,63.49 U1.SDA 32.54,63.6 23.85,72.29 23.85,79.15 U$3.J1.4
  Bottom 0.508: U$3.J1.4 23.85,79.26 23.85,98.08 U$2.18/A4
SERVO
  Top 0.508: U$2.21/A7 26.31,107.97 19.75,107.97 18.6,109.13 SERVO.1
SPEED_DATA
  Top 0.508: U$2.23/A9 26.43,113.09 18.6,113.09 16.94,114.75 AIRSPEED_SENSOR.2
STABILIZE
  Top 0.508: U$2.20/A6 26.42,105.33 20.91,105.33 18.6,103.02 SERVO1.1
TX_PM2.5
  Bottom 0.508: PM2.5.2 64.22,84.17 61.38,87 59.33,87 51.24,95.1 42.29,95.1 U$2.9
TXBEE
  Top 0.508: XB1.2 44.86,112.29 40.4,112.29 40.4,118.44 40.46,118.51 U$2.0
TXGPS
  Top 0.508: U$1.TX 40.06,34.01 40.06,36.16 43.36,39.46 U$4.TX
  Bottom 0.508: U$2.8 41.34,98.19 37.94,94.79 37.94,83.77 43.36,78.35 43.36,39.67 U$4.TX
(copper drawn outside any net)
  shapes: Top area x21